# Altium schematic sheet Cathode.SchDoc
size A4; DocumentNumber: 1; SheetNumber: 1
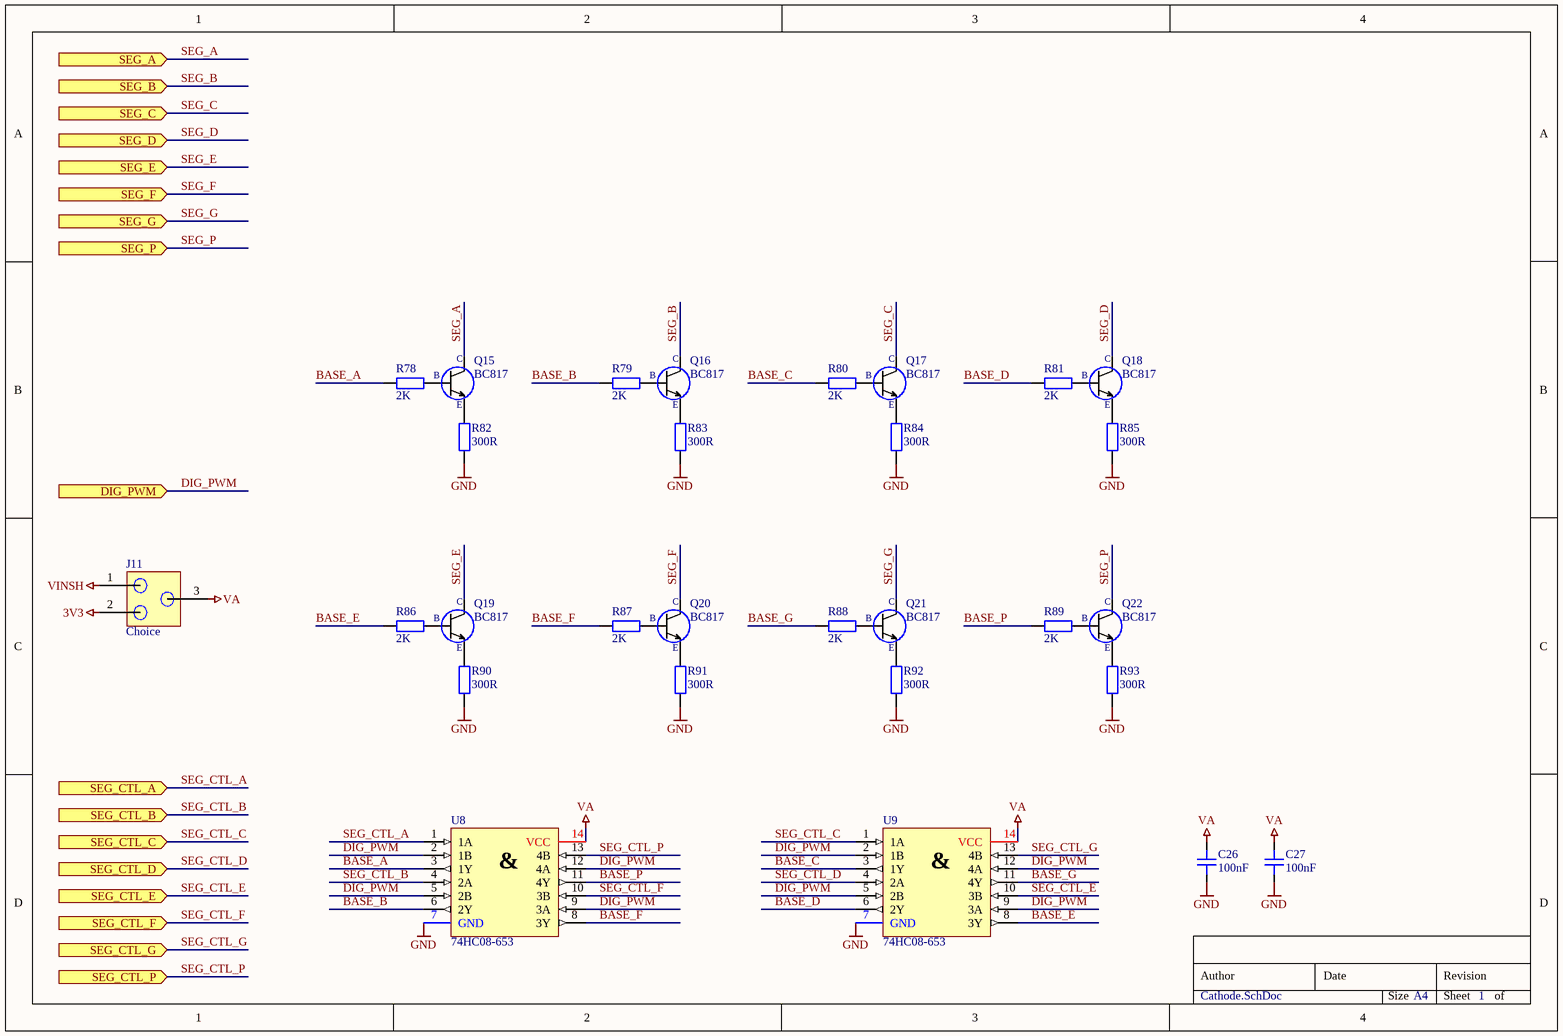
[diagram p0: Cathode.SchDoc]

## Parts
C26  100nF  [0805C_RF_M]
C27  100nF  [0805C_RF_M]
J11  Choice  [CHOICE_R0805]
Q15  BC817  [IRLML_SOT-23]
Q16  BC817  [IRLML_SOT-23]
Q17  BC817  [IRLML_SOT-23]
Q18  BC817  [IRLML_SOT-23]
Q19  BC817  [IRLML_SOT-23]
Q20  BC817  [IRLML_SOT-23]
Q21  BC817  [IRLML_SOT-23]
Q22  BC817  [IRLML_SOT-23]
R78  2K  [0805R_RF_M]
R79  2K  [0805R_RF_M]
R80  2K  [0805R_RF_M]
R81  2K  [0805R_RF_M]
R82  300R  [0805R_RF_M]
R83  300R  [0805R_RF_M]
R84  300R  [0805R_RF_M]
R85  300R  [0805R_RF_M]
R86  2K  [0805R_RF_M]
R87  2K  [0805R_RF_M]
R88  2K  [0805R_RF_M]
R89  2K  [0805R_RF_M]
R90  300R  [0805R_RF_M]
R91  300R  [0805R_RF_M]
R92  300R  [0805R_RF_M]
R93  300R  [0805R_RF_M]
U8  74HC08-653  [SOIC-14]
U9  74HC08-653  [SOIC-14]

## Ports
DIG_PWM (in), SEG_A (in), SEG_B (in), SEG_C (in), SEG_CTL_A (in), SEG_CTL_B (in), SEG_CTL_C (in), SEG_CTL_D (in), SEG_CTL_E (in), SEG_CTL_F (in), SEG_CTL_G (in), SEG_CTL_P (in), SEG_D (in), SEG_E (in), SEG_F (in), SEG_G (in), SEG_P (in)

## Nets
3V3: J11.2
GND: C26.1 C27.1 R82.1 R83.1 R84.1 R85.1 R90.1 R91.1 R92.1 R93.1 U8.7(GND) U9.7(GND)
VA: C26.2 C27.2 J11.3 U8.14(VCC) U9.14(VCC)
VINSH: J11.1
BASE_A: R78.1 U8.3(1Y)
BASE_B: R79.1 U8.6(2Y)
BASE_C: R80.1 U9.3(1Y)
BASE_D: R81.1 U9.6(2Y)
BASE_E: R86.1 U9.8(3Y)
BASE_F: R87.1 U8.8(3Y)
BASE_G: R88.1 U9.11(4Y)
BASE_P: R89.1 U8.11(4Y)
DIG_PWM: U8.2(1B) U8.5(2B) U8.9(3A) U8.12(4A) U9.2(1B) U9.5(2B) U9.9(3A) U9.12(4A) ; port DIG_PWM
SEG_A: Q15.3(Collector) ; port SEG_A
SEG_B: Q16.3(Collector) ; port SEG_B
SEG_C: Q17.3(Collector) ; port SEG_C
SEG_CTL_A: U8.1(1A) ; port SEG_CTL_A
SEG_CTL_B: U8.4(2A) ; port SEG_CTL_B
SEG_CTL_C: U9.1(1A) ; port SEG_CTL_C
SEG_CTL_D: U9.4(2A) ; port SEG_CTL_D
SEG_CTL_E: U9.10(3B) ; port SEG_CTL_E
SEG_CTL_F: U8.10(3B) ; port SEG_CTL_F
SEG_CTL_G: U9.13(4B) ; port SEG_CTL_G
SEG_CTL_P: U8.13(4B) ; port SEG_CTL_P
SEG_D: Q18.3(Collector) ; port SEG_D
SEG_E: Q19.3(Collector) ; port SEG_E
SEG_F: Q20.3(Collector) ; port SEG_F
SEG_G: Q21.3(Collector) ; port SEG_G
SEG_P: Q22.3(Collector) ; port SEG_P
NetQ15_1: Q15.1(Base) R78.2
NetQ15_2: Q15.2(Emmiter) R82.2
NetQ16_1: Q16.1(Base) R79.2
NetQ16_2: Q16.2(Emmiter) R83.2
NetQ17_1: Q17.1(Base) R80.2
NetQ17_2: Q17.2(Emmiter) R84.2
NetQ18_1: Q18.1(Base) R81.2
NetQ18_2: Q18.2(Emmiter) R85.2
NetQ19_1: Q19.1(Base) R86.2
NetQ19_2: Q19.2(Emmiter) R90.2
NetQ20_1: Q20.1(Base) R87.2
NetQ20_2: Q20.2(Emmiter) R91.2
NetQ21_1: Q21.1(Base) R88.2
NetQ21_2: Q21.2(Emmiter) R92.2
NetQ22_1: Q22.1(Base) R89.2
NetQ22_2: Q22.2(Emmiter) R93.2

## Notes on the sheet
- Author
- Date
- Revision
- Size
- A4
- Sheet
- of
- (in symbol 74HC08-653) &
- (in symbol BC817-40-215) C; B; E

## Library data of the parts
C26 C27 = C: Capacitor; Manufacturer: Generic Brand; Max Voltage: ? V; Value: 100nF; Tolerance: ?; Mounting Technology: SMT; Tag: *; Manufacturer Part No: *; Supplier: *; Supplier Link: http://; Supplier Part No: *; Category: Capacitor
Q15-Q22 = BC817-40-215: TRANS NPN 45V 0.5A SOT23; Manufacturer: Nexperia USA Inc.; Manufacturer Part No: BC817-40,215; Collector Current: 500 mA; Collector-Emitter Breakdown Voltage: 45V (max.); Power Dissipation: 250 mW; DC Current Gain: 250 @ 100mA, 1V; Supplier: DigiKey; Supplier Link: https://www.digikey.com/en/products/detail/nexperia-usa-inc/BC817-40-215/763235; Supplier Part No: 1727-2919-1-ND; Mounting Technology: SMT; Category: Transistor/BJT; Alternative Supplier: Chipdip; Alternative Supplier Link: https://www.chipdip.by/product/bc817-40; Alternative Supplier Part No: 28806907; Datasheet Link: https://assets.nexperia.com/documents/data-sheet/BC817_SER.pdf; Package: SOT-23
R78-R93 = R: Resistor; Manufacturer: Generic Brand; Power Rating: ? W; Max Voltage: ? V; Tolerance: ?; Supplier Link: http://; Category: Resistor; Mounting Technology: SMT
  R78-R81 R86-R89: Value: 2K
  R82-R85 R90-R93: Value: 300R
U8 U9 = 74HC08-653: Manufacturer: NXP